# EasyEDA Pro project BLDC大功率驱动器.epro, board PCB1
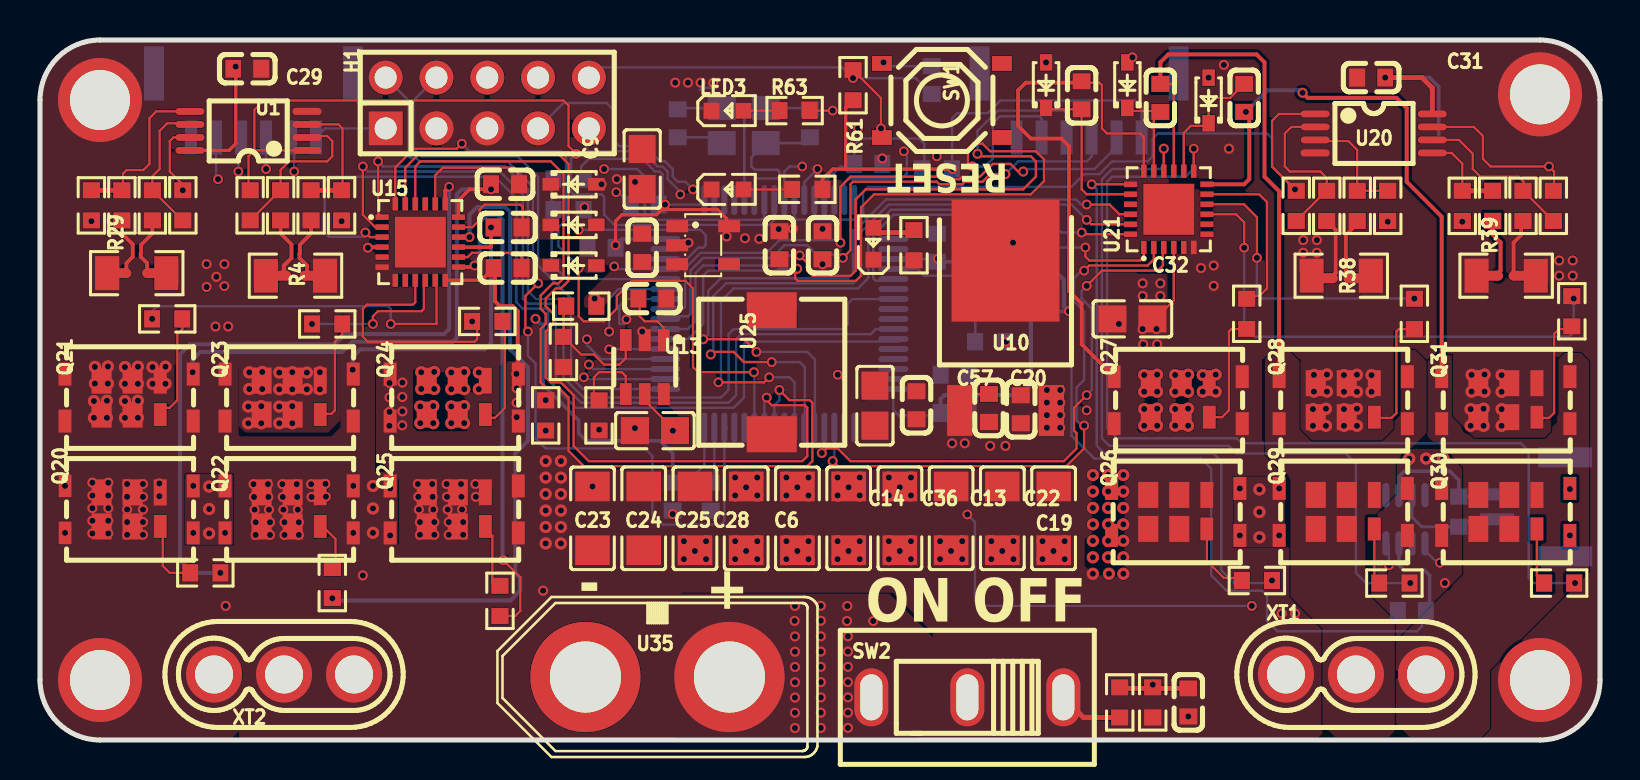
[diagram p3: board, top side]
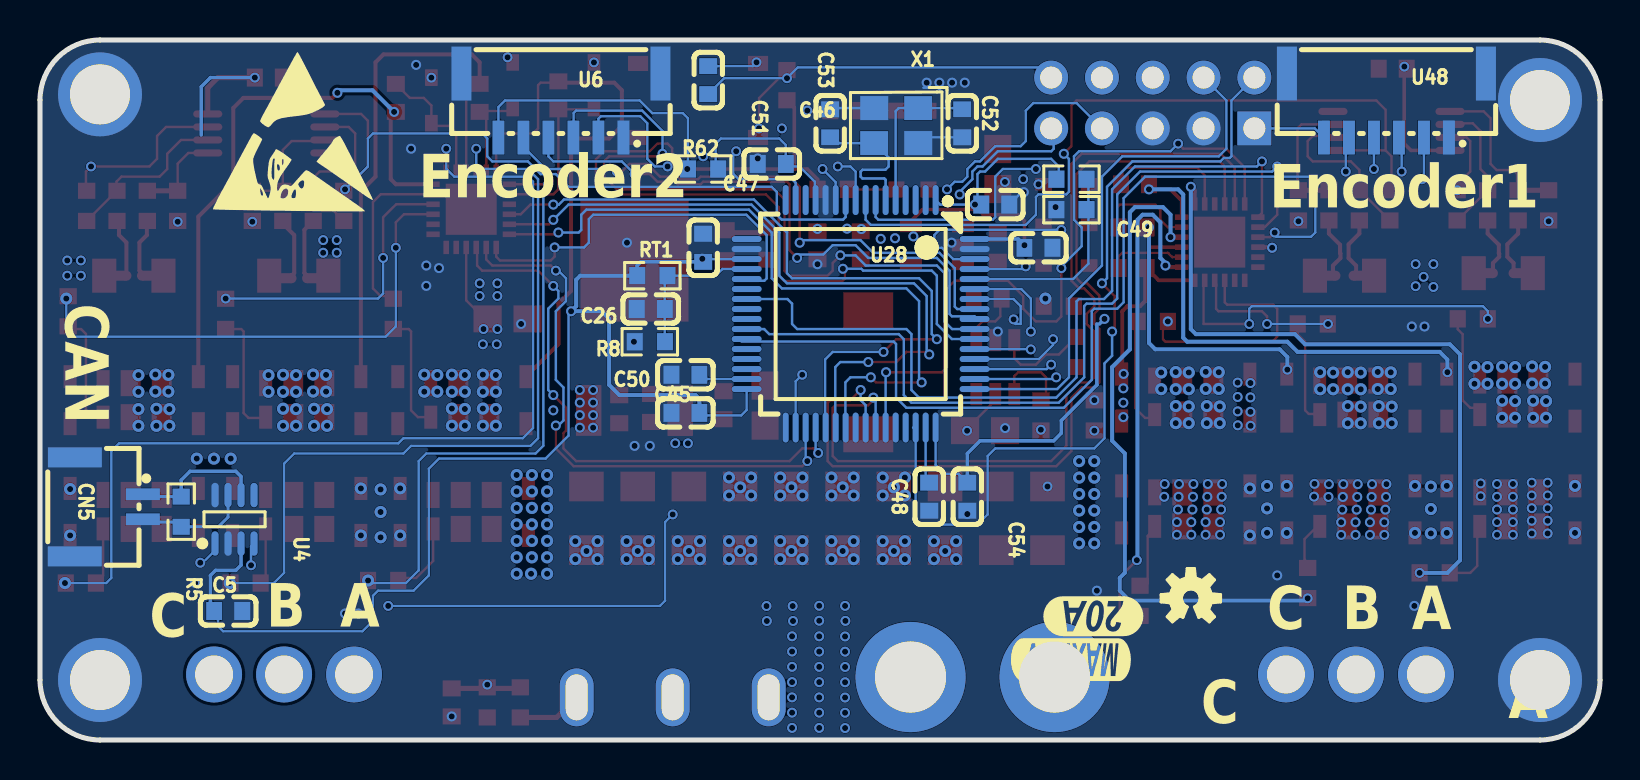
[diagram p4: board, bottom side, seen from below]

Outline 78 x 35 mm; copper layers: Top Layer, Inner1, Inner2, Bottom Layer. Coordinates in mm from the lower left corner of the outline.
Outline path: 0,32 0,3 arc(0.88,0.88) 3,0 75,0 arc(77.12,0.88) 78,3 78,32 arc(77.12,34.12) 75,35 3,35 arc(0.88,34.12) 0,32
Stack: Top Layer 0.035mm 外层铜厚1oz / Dielectric1 0.2104mm 7628 RC49% 8.6mil / Inner1 0.0152mm 内层铜厚 / Dielectric2 1.065mm 1.1mm H/HOZ Copper / Inner2 0.0152mm 内层铜厚 / Dielectric3 0.2104mm 7628 RC49% 8.6mil / Bottom Layer 0.035mm 外层铜厚1oz

## Design rules (mm)
net SPB1: DP4
net SPA1: DP3
net SPB2: DP1
net SPC2: DP2
net OS_8M_IN: DP5
net OS_8M_OUT: DP5
net SNB1: DP4
net SNA1: DP3
net SNC2: DP2
net SNB2: DP1
template: 自定义配置
spacing copperThickness1oz (default): track to track 0.076, other pairs 0.102 to 0.3
spacing copperThickness2oz: track to track 0.203, other pairs 0.152 to 0.3
track width copperThickness1oz (default): min 0.102, default 0.119, max 2.54
track width copperThickness2oz: min 0.102, default 0.119, max 2.54
differential pair differentialPair (default): width min 0.127, default 0.254, max 2.54; gap min 0.152, default 0.152
via viaSize (default): diameter min 0.5, default 0.5, max 10; hole min 0.3, default 0.305, max 6.3
net SHB2 uses copperRegion1
net SHC2 uses copperRegion1
net SPC2 uses copperRegion1

## Placement (name value [footprint] x y rotation side)
1  OSHW-LOGOS  [OSHW-LOGO-S]  20.46 7.09 180 bottom
BOOT_RES  0  [R0603]  26.43 28.04 180 bottom
C1  2.2uF 16V  [C0603]  23.38 25.63 0 top
C5  100nf 6.3v  [C0603]  68.59 6.45 180 bottom
C6  4.7uF/50V  [C1206]  37.87 11.08 270 top
C9  10uF 16V  [C0805]  30.11 28.55 90 top
C10  4.7uf 16V  [C0603]  43.83 16.74 90 top
C13  4.7uF/50V  [C1206]  45.56 11.08 270 top
C14  4.7uF/50V  [C1206]  40.43 11.08 270 top
C16  100nf 6.3v  [C0603]  57.41 1.88 90 top
C17  10uF 16V  [C0805]  41.75 16.72 90 top
C18  2.2uF 16V  [C0603]  23.38 23.6 0 top
C19  4.7uF/50V  [C1206]  50.68 11.08 270 top
C20  1uF  [C0603]  49.04 16.54 270 top
C22  4.7uF/50V  [C1206]  48.12 11.08 270 top
C23  4.7uF/50V  [C1206]  27.62 11.08 270 top
C24  4.7uF/50V  [C1206]  30.19 11.08 270 top
C25  4.7uF/50V  [C1206]  32.75 11.08 270 top
C26  2.2uf 6.3V  [C0603]  47.46 21.55 0 bottom
C27  2.2uF 16V  [C0603]  23.25 27.79 0 top
C28  4.7uF/50V  [C1206]  35.31 11.08 270 top
C29  100nf 6.3v  [C0603]  10.36 33.56 0 top
C31  100nf 6.3v  [C0603]  66.56 33.12 180 top
C32  10uF 16V  [C0805]  54.62 21.06 180 top
C33  2.2uF 16V  [C0603]  56.02 32.11 270 top
C34  2.2uF 16V  [C0603]  60.21 32.11 90 top
C35  2.2uF 16V  [C0603]  52.08 32.23 270 top
C36  4.7uF/50V  [C1206]  43 11.08 270 top
C39  100nf 50V  [C0603]  30.62 22.07 0 top
C40  2.2uf 100V  [C0805]  30.75 15.47 0 top
C41  1uf 6.3v  [C0603]  30.11 24.61 270 top
C42  100nf 6.3v  [C0603]  39.13 24.74 90 top
C43  1uf 6.3v  [C0603]  36.97 24.74 90 top
C44  100nF  [C0603]  30.24 26.77 180 bottom
C45  100nF  [C0603]  45.73 16.36 0 bottom
C46  100nF  [C0603]  41.41 28.8 0 bottom
C47  100nF  [C0603]  44.84 24.61 90 bottom
C48  2.2uF  [C0603]  33.54 12.17 270 bottom
C49  100nF  [C0603]  28.08 24.61 0 bottom
C50  2.2uF  [C0603]  45.73 18.26 180 bottom
C51  100nF  [C0603]  44.59 32.99 90 bottom
C52  20pF  [C0603]  31.89 30.83 270 bottom
C53  20pF  [C0603]  38.49 30.83 270 bottom
C54  100nF  [C0603]  31.63 12.17 90 bottom
C57  10uF  [C0603]  47.45 16.6 270 top
CN5  GH1.25-2P  [CONN-SMD_2P-P1.25_GH1.25-2P]  74.56 11.66 270 bottom
H1  -  [HDR-TH_10P-P2.54-V-M-R2-C5-S2.54]  22.36 31.85 0 top
LED3  -  [LED_0603]  34.43 31.47 0 top
LED4  -  [LED_0603]  34.43 27.53 0 top
LED5  -  [LED_0603]  41.67 24.87 90 top
Q20  IRF7480MTRPBF  [TRS-SMD_IRF7480MTRPBF]  4.46 11.53 180 top
Q21  IRF7480MTRPBF  [TRS-SMD_IRF7480MTRPBF]  4.46 17.12 180 top
Q22  IRF7480MTRPBF  [TRS-SMD_IRF7480MTRPBF]  12.46 11.53 180 top
Q23  IRF7480MTRPBF  [TRS-SMD_IRF7480MTRPBF]  12.46 17.12 180 top
Q24  IRF7480MTRPBF  [TRS-SMD_IRF7480MTRPBF]  20.71 17.12 180 top
Q25  IRF7480MTRPBF  [TRS-SMD_IRF7480MTRPBF]  20.71 11.53 180 top
Q26  IRF7480MTRPBF  [TRS-SMD_IRF7480MTRPBF]  56.79 11.4 180 top
Q27  IRF7480MTRPBF  [TRS-SMD_IRF7480MTRPBF]  56.91 16.99 180 top
Q28  IRF7480MTRPBF  [TRS-SMD_IRF7480MTRPBF]  65.16 16.99 180 top
Q29  IRF7480MTRPBF  [TRS-SMD_IRF7480MTRPBF]  65.16 11.4 180 top
Q30  IRF7480MTRPBF  [TRS-SMD_IRF7480MTRPBF]  73.29 11.4 180 top
Q31  IRF7480MTRPBF  [TRS-SMD_IRF7480MTRPBF]  73.29 16.99 180 top
R1  2.2R  [R0603]  8.27 8.36 0 top
R2  2.2R  [R0603]  6.36 21.06 180 top
R4  1mR  [R1206]  12.77 23.22 0 top
R5  120R  [R0603]  70.94 11.42 90 bottom
R8  3.3k  [R0603]  47.51 19.91 180 bottom
R11  1k  [R0603]  55.64 1.88 90 top
R12  2.2R  [R0603]  14.62 7.85 270 top
R13  2.2R  [R0603]  14.36 20.8 180 top
R15  30K  [R0603]  7.14 26.73 90 top
R16  30K  [R0603]  10.51 26.73 90 top
R18  0R  [R0603]  25.28 16.23 90 top
R19  1K  [R0603]  12.03 26.73 270 top
R20  30K  [R0603]  2.57 26.73 90 top
R21  510R  [R0603]  13.56 26.73 270 top
R22  30K  [R0603]  15.08 26.73 270 top
R23  1K  [R0603]  5.62 26.73 90 top
R24  18k  [R0603]  53.99 1.88 270 top
R26  510R  [R0603]  4.09 26.73 90 top
R27  2.2R  [R0603]  23 6.96 270 top
R28  2.2R  [R0603]  22.36 20.93 180 top
R29  1mR  [R1206]  4.84 23.34 180 top
R30  1K  [R0603]  26.17 19.41 90 top
R31  100K  [R0603]  27.95 16.23 270 top
R38  1mR  [R1206]  65.06 23.22 0 top
R39  1mR  [R1206]  73.31 23.22 180 top
R40  2.2R  [R0603]  60.84 7.97 0 top
R41  2.2R  [R0603]  60.34 21.31 90 top
R42  2.2R  [R0603]  67.72 7.85 0 top
R43  2.2R  [R0603]  68.72 21.31 90 top
R44  2.2R  [R0603]  75.96 7.85 0 top
R45  2.2R  [R0603]  76.59 21.44 90 top
R51  30K  [R0603]  75.67 26.71 90 top
R52  30K  [R0603]  71.12 26.71 90 top
R53  510R  [R0603]  72.63 26.71 90 top
R54  1K  [R0603]  74.15 26.71 90 top
R55  30K  [R0603]  62.81 26.71 90 top
R56  30K  [R0603]  67.38 26.71 270 top
R57  1K  [R0603]  64.34 26.71 270 top
R58  510R  [R0603]  65.86 26.71 270 top
R59  5.36K  [R0603]  27.06 21.69 0 top
R60  1.5K  [R0603]  26.43 26.52 0 bottom
R61  10K  [R0603]  40.65 32.74 90 top
R62  0  [R0603]  44.84 28.55 180 bottom
R63  10K  [R0603]  37.73 31.47 180 top
R64  10K  [R0603]  38.37 27.53 180 top
R65  10K  [R0603]  43.7 24.74 90 top
RT1  10k  [R0603]  47.38 23.22 0 bottom
SW1  TS-1187A-B-A-B  [SW-SMD_4P-L5.1-W5.1-P3.70-LS6.5-TL_H1.5]  45.1 31.98 0 top
SW2  SS12D10G4  [SW-TH_3P-P4.80-HX-SS12D10G4]  46.37 2.13 180 top
U1  LMV358IPWRG4  [TSSOP-8_L4.4-W3.0-P0.65-LS6.4-BL]  10.42 30.45 90 top
U4  MAX3051EKA+T  [SOT-23-8_L3.0-W1.7-P0.65-LS2.8-TL]  68.27 11.04 90 bottom
U6  GH1.25-6PWBPZ  [CONN-SMD_6P-P1.25_GH1.25-6PWBPZ]  51.95 31.72 0 bottom
U10  CJ7812  [TO-252-3_L6.5-W5.8-P4.58-BL]  48.28 20.22 0 top
U13  JW5026  [SOT-23-6_L2.9-W1.6-P0.95-LS2.8-BR]  30.24 18.64 90 top
U14  SPX3819M5-L-3-3/TR  [SOT-23-5_L3.0-W1.7-P0.95-LS2.8-BR]  33.16 24.74 180 top
U15  FD6288Q_C328453  [QFN-24_L4.0-W4.0-P0.50-BL-EP2.6]  19.01 24.89 270 top
U16  1N5819WS  [SOD-323_L1.7-W1.3-LS2.6-RD]  26.68 23.72 0 top
U17  1N5819WS  [SOD-323_L1.7-W1.3-LS2.6-RD]  26.68 27.79 0 top
U18  1N5819WS  [SOD-323_L1.7-W1.3-LS2.6-RD]  26.68 25.75 0 top
U20  LMV358IPWRG4  [TSSOP-8_L4.4-W3.0-P0.65-LS6.4-BL]  66.69 30.33 270 top
U21  FD6288Q_C328453  [QFN-24_L4.0-W4.0-P0.50-BL-EP2.6]  56.44 26.54 0 top
U22  1N5819WS  [SOD-323_L1.7-W1.3-LS2.6-RD]  58.43 31.98 90 top
U23  1N5819WS  [SOD-323_L1.7-W1.3-LS2.6-RD]  50.3 32.74 90 top
U24  1N5819WS  [SOD-323_L1.7-W1.3-LS2.6-RD]  54.37 32.74 90 top
U25  4.7uH 3A  [IND-SMD_L7.3-W7.3_GSDRH74P]  36.59 18.39 90 top
U28  stm32f407rgt6  [LQFP-64_L10.0-W10.0-P0.50-LS12.0-BL]  36.97 21.31 0 bottom
U29  -  [M3]  75 3 0 top
U30  -  [M3]  75 32.28 0 top
U31  -  [M3]  3 3 0 top
U32  -  [M3]  3 32 0 top
U35  XT60PB-M  [CONN-TH_XT60PB-M]  30.87 3.15 0 top
U38  -  [网络连接]  64.15 23.09 180 top
U39  -  [网络连接]  65.92 23.09 0 top
U40  -  [网络连接]  72.4 23.22 180 top
U41  -  [网络连接]  74.18 23.22 0 top
U44  -  [网络连接]  11.82 23.22 180 top
U45  -  [网络连接]  13.73 23.22 0 top
U46  -  [网络连接]  3.82 23.34 180 top
U47  -  [网络连接]  5.85 23.34 0 top
U48  GH1.25-6PWBPZ  [CONN-SMD_6P-P1.25_GH1.25-6PWBPZ]  10.68 31.72 0 bottom
X1  8MHz  [CRYSTAL-SMD_4P-L3.2-W2.5-BL-1]  35.19 30.72 0 bottom
XT1  MR30  [CONN-TH_MR30PB-M]  65.8 3.28 0 top
XT2  MR30  [CONN-TH_MR30PB-M]  12.2 3.28 0 top

## Footprints (pads in the part's own frame, mm; a bottom-side part is the same pattern mirrored in y, then rotated)
C0603
  rect 0.8x0.9 smd: 1(-0.7,0) 2(0.7,0)
C0805
  rect 1.41x1.35 smd: 1(-1,0) 2(1,0)
C1206
  rect 1.485x1.728 smd: 1(-1.593,0) 2(1.593,0)
CONN-SMD_2P-P1.25_GH1.25-2P
  rect 0.6x1.7 smd: 1(-0.625,1.702) 2(0.625,1.702)
  rect 1x2.7 smd: 3(2.475,-1.702) 4(-2.475,-1.698)
CONN-SMD_6P-P1.25_GH1.25-6PWBPZ
  rect 0.6x1.7 smd: 1(-3.125,1.6) 2(-1.875,1.6) 3(-0.625,1.6) 4(0.625,1.6) 5(1.875,1.6) 6(3.125,1.6)
  rect 1x2.7 smd: 7(-4.975,-1.6) 8(4.975,-1.6)
CONN-TH_MR30PB-M
  round 2.8 hole 1.9: 1(-3.5,0) 2(0,0) 3(3.5,0)
CONN-TH_XT60PB-M
  round 5.516 hole 3.556: 1(3.6,0) 2(-3.6,0)
CRYSTAL-SMD_4P-L3.2-W2.5-BL-1
  rect 1.4x1.2 smd: 1(-1.1,-0.875) 2(1.1,-0.875) 3(1.1,0.875) 4(-1.1,0.875)
HDR-TH_10P-P2.54-V-M-R2-C5-S2.54
  rect 1.7x1.7 hole 1.1: 1(-5.08,-1.27)
  round 1.7 hole 1.1: 2(-5.08,1.27) 3(-2.54,-1.27) 4(-2.54,1.27) 5(0,-1.27) 6(0,1.27) 7(2.54,-1.27) 8(2.54,1.27) 9(5.08,-1.27) 10(5.08,1.27)
IND-SMD_L7.3-W7.3_GSDRH74P
  rect 1.8x2.5 smd: 1(-3.1,0) 2(3.1,0)
LED_0603
  rect 0.8x0.8 smd: 1(-0.851,-0.01) 2(0.75,-0.005)
LQFP-64_L10.0-W10.0-P0.50-LS12.0-BL
  oval 0.3x1.5 smd: 1(-3.75,-5.688) 2(-3.25,-5.688) 3(-2.75,-5.688) 4(-2.25,-5.688) 5(-1.75,-5.688) 6(-1.25,-5.688) 7(-0.75,-5.688) 8(-0.25,-5.688) 9(0.25,-5.688) 10(0.75,-5.688) 11(1.25,-5.688) 12(1.75,-5.688) 13(2.25,-5.688) 14(2.75,-5.688) 15(3.25,-5.688) 16(3.75,-5.688) 33(3.75,5.688) 34(3.25,5.688) 35(2.75,5.688) 36(2.25,5.688) 37(1.75,5.688) 38(1.25,5.688) 39(0.75,5.688) 40(0.25,5.688) 41(-0.25,5.688) 42(-0.75,5.688) 43(-1.25,5.688) 44(-1.75,5.688) 45(-2.25,5.688) 46(-2.75,5.688) 47(-3.25,5.688) 48(-3.75,5.688)
  oval 1.5x0.3 smd: 17(5.7,-3.738) 18(5.7,-3.238) 19(5.7,-2.738) 20(5.7,-2.238) 21(5.7,-1.738) 22(5.7,-1.238) 23(5.7,-0.739) 24(5.7,-0.238) 25(5.7,0.262) 26(5.7,0.762) 27(5.7,1.262) 28(5.7,1.762) 29(5.7,2.261) 30(5.7,2.762) 31(5.7,3.261) 32(5.7,3.762) 49(-5.7,3.762) 50(-5.7,3.261) 51(-5.7,2.762) 52(-5.7,2.261) 53(-5.7,1.762) 54(-5.7,1.262) 55(-5.7,0.762) 56(-5.7,0.262) 57(-5.7,-0.238) 58(-5.7,-0.739) 59(-5.7,-1.238) 60(-5.7,-1.738) 61(-5.7,-2.238) 62(-5.7,-2.738) 63(-5.7,-3.238) 64(-5.7,-3.738)
M3
  round 4.2 hole 3: 1(0,0)
QFN-24_L4.0-W4.0-P0.50-BL-EP2.6
  rect 0.28x0.665 smd: 1(-1.25,-1.907) 2(-0.75,-1.907) 3(-0.25,-1.907) 4(0.25,-1.907) 5(0.75,-1.907) 6(1.25,-1.907) 13(1.25,1.907) 14(0.75,1.907) 15(0.25,1.907) 16(-0.25,1.907) 17(-0.75,1.907) 18(-1.25,1.907)
  rect 0.665x0.28 smd: 7(1.907,-1.25) 8(1.907,-0.75) 9(1.907,-0.25) 10(1.907,0.25) 11(1.907,0.75) 12(1.907,1.25) 19(-1.907,1.25) 20(-1.907,0.75) 21(-1.907,0.25) 22(-1.907,-0.25) 23(-1.907,-0.75) 24(-1.907,-1.25)
  rect 2.55x2.55 smd: 25(0,0)
R0603
  rect 0.806x0.864 smd: 1(-0.753,0) 2(0.753,0)
R1206
  rect 1.208x1.701 smd: 1(-1.479,0) 2(1.479,0)
SOD-323_L1.7-W1.3-LS2.6-RD
  rect 0.83x0.63 smd: 1(-1.14,0) 2(1.14,0)
SOT-23-5_L3.0-W1.7-P0.95-LS2.8-BR
  rect 1.1x0.6 smd: 1(1.3,-0.95) 2(1.3,0) 3(1.3,0.95) 4(-1.3,0.95) 5(-1.3,-0.95)
SOT-23-6_L2.9-W1.6-P0.95-LS2.8-BR
  rect 1.1x0.6 smd: 1(1.35,-0.95) 2(1.35,0) 3(1.35,0.95) 4(-1.35,0.95) 5(-1.35,0) 6(-1.35,-0.95)
SOT-23-8_L3.0-W1.7-P0.65-LS2.8-TL
  oval 1.222x0.364 smd: 1(-1.211,0.975) 2(-1.211,0.325) 3(-1.211,-0.325) 4(-1.211,-0.975) 5(1.211,-0.975) 6(1.211,-0.325) 7(1.211,0.325) 8(1.211,0.975)
SW-SMD_4P-L5.1-W5.1-P3.70-LS6.5-TL_H1.5
  rect 1x0.75 smd: 1(-3,1.85) 2(3,1.85) 3(-3,-1.85) 4(3,-1.85)
SW-TH_3P-P4.80-HX-SS12D10G4
  oval 1.7x2.9 hole 1.1x2.3: 1(-4.8,0) 2(0,0) 3(4.8,0)
TO-252-3_L6.5-W5.8-P4.58-BL
  rect 1.27x2.54 smd: 1(-2.288,-3.747) 3(2.288,-3.745)
  rect 5.4x6.1 smd: 2(-0.002,3.747)
TRS-SMD_IRF7480MTRPBF
  rect 0.65x1.15 smd: 1(-1.555,0.85) 7(-3.205,1.175) 8(-3.205,-1.175) 9(3.205,-1.175) 10(3.205,1.175)
  rect 1x1.3 smd: 2(-0.175,0.85) 3(1.375,0.85) 4(1.375,-0.85) 5(-0.175,-0.85)
  rect 0.65x1.3 smd: 6(-1.555,-0.85)
TSSOP-8_L4.4-W3.0-P0.65-LS6.4-BL
  oval 0.353x1.454 smd: 1(-0.975,-2.927) 2(-0.325,-2.927) 3(0.325,-2.927) 4(0.975,-2.927) 5(0.975,2.927) 6(0.325,2.927) 7(-0.325,2.927) 8(-0.975,2.927)
网络连接
  round 0.5 smd: 1(-0.5,0) 2(0.5,0)

## Nets
As in the schematic.

Pads without a net: H1 6 8; SW1 2 4; U4 5; U14 4; U15 5 7 8 21 25; U21 5 7 8 21 25; U28 2 3 4 14 22 44 45

## Via types
v1: diameter 0.5, hole 0.305, Top Layer to Bottom Layer, 291 vias
v2: diameter 0.61, hole 0.305, Top Layer to Bottom Layer, 234 vias
v3: diameter 0.508, hole 0.305, Top Layer to Bottom Layer, 2 vias

## Routing (per net, layer and track width the routed paths; a pad name or vN(x,y) marks a point on that pad's centre or on a via; arc(x,y) is an arc through that point)
5V:
  vias: v2(27.73,22.07)
12V: length 17.6
  Top Layer w0.119: U21.4 56.69,21.98 56.27,21.56 55.62,21.56
  Top Layer w0.201: 17.1,24.64 16.43,24.64 v3(16.39,24.61)
  Inner2 w0.178: v3(16.39,24.61) 24.4,24.61 27.57,27.79 v1(28.08,27.79)
  vias: v1(28.84,28.04) v1(29.75,27.9) v1(50.3,33.88) v1(50.34,17.5) v1(50.34,16.87) v1(50.34,16.24) v1(50.34,15.61) v1(51.01,17.5) v1(51.01,16.87) v1(51.01,16.24) v1(51.01,15.61) v1(54.62,34.13) v1(55.13,22.83) v1(55.13,22.2) v1(55.13,20.55) v1(55.16,19.79) v1(55.83,20.55) v1(55.86,19.79) v1(56.02,22.83) v1(56.02,22.2) v1(58.43,33.12)
DGND: length 8
  Inner2 w0.119: 28.84,16.74 29.75,15.83 v1(29.75,15.59)
  Bottom Layer w0.119: C53.1 38.43,31.6 X1.2 ; 32.98,32.49 33.11,32.61 33.83,32.61 ; v1(28.81,27.39) 28.92,27.39 C44.2 ; 34.09,29.84 33.8,30.14 31.89,30.14
  vias: v1(8.77,20.67) v1(9.28,6.7) v1(9.41,20.67) v1(16.14,8.23) v1(25.16,7.47) v1(25.28,16.99) v1(27.22,26.64) v1(30.11,20.42) v1(31.63,11.3) v1(31.76,32.87) v1(32.4,32.87) v1(32.42,24.87) v1(33.03,32.87) v1(33.67,32.87) v1(39.13,23.79) v1(42.11,29.08) v1(47.51,14.71) v1(48.3,19.91) v1(48.27,14.71) v1(48.65,24.87) v1(53.95,20.8) v1(57.41,1.18) v1(58.05,23.6) v1(58.69,23.72) v1(58.69,22.71) v1(59.19,33.76) v1(59.45,29.56) v1(62.09,6.32) v1(62.75,6.32) v1(70.24,7.85)
PGND: length 0
  Top Layer w0.119: R18.1 v1(25.28,15.47)
  vias: v1(8.33,23.79) v1(8.33,22.65) v1(8.82,23.16) v1(9.22,23.79) v1(9.22,22.69) v1(27.62,12.68) v1(63.16,25) v1(63.16,24.36) v1(63.84,25) v1(63.84,24.36) v1(75.96,23.98) v1(75.96,23.22) v1(76.64,23.98) v1(76.64,23.22) v2(19.01,16.68) v2(19.01,15.84) v2(19.06,18.39) v2(19.06,17.55) v2(19.71,18.41) v2(19.71,17.55) v2(19.66,16.7) v2(19.66,15.84) v2(20.56,18.38) v2(20.56,17.54) v2(20.56,16.68) v2(20.56,15.84) v2(21.21,18.4) v2(21.21,17.54) v2(21.21,16.7) v2(21.21,15.84) v2(21.94,18.38) v2(21.94,17.54) v2(34.76,13.12) v2(34.76,12.23) v2(35.3,12.63) v2(35.86,13.12) v2(35.86,12.23) v2(37.32,13.12) v2(37.32,12.23) v2(37.87,12.63) v2(38.42,13.12) v2(38.42,12.23) v2(39.88,13.12) v2(39.88,12.23) v2(40.43,12.63) v2(40.99,13.12) v2(40.99,12.23) v2(42.44,13.12) v2(42.44,12.23) v2(42.99,12.63) v2(43.55,13.12) v2(43.55,12.23) v2(55.21,18.25) v2(55.21,17.41) v2(55.21,16.55) v2(55.21,15.71) v2(55.86,18.27) v2(55.86,17.41) v2(55.86,16.57) v2(55.86,15.71) v2(56.76,18.25) v2(56.76,17.41) v2(56.76,16.55) v2(56.76,15.71) v2(57.41,18.27) v2(57.41,17.41) v2(57.41,16.57) v2(57.41,15.71) v2(58.14,18.25) v2(58.14,17.41) v2(58.79,18.27) v2(58.79,17.41)
VBUS_S_PA1: length 47.7
  Top Layer w0.254: C16.2 54.04,2.58 R24.1
  Inner1 w0.119: v1(55.64,2.77) 55.38,3.02 55.38,13.94 55.13,14.2 53.22,14.2 52.72,14.71 52.72,16.36 52.59,16.48 v1(52.34,16.48) 52.84,16.99 52.84,18.77 51.95,19.66 51.95,22.07 51.45,22.58 51.45,29.18 50.3,30.33 44.08,30.33 v1(43.19,29.44)
  Bottom Layer w0.119: v1(43.19,29.44) 43.34,29.29 43.34,28.32 43.06,28.04 40.4,28.04 40.22,27.86 U28.15
VCC: length 146.4
  Top Layer w0.178: C29.1 9.79,33.44 9.79,29.82 9.45,29.48 U1.8 ; R64.1 39.12,28.03 39.63,28.55 40.28,28.55 ; 40.28,28.55 v1(45.64,28.55) ; 40.28,28.55 40.28,31.62 R61.1 ; v1(28.78,24.74) 28.78,25.95 29.09,26.26 30.83,26.26 31.13,26.56 31.16,26.52 33.88,26.52 34.33,26.07 v1(34.33,25.18)
  Top Layer w0.254: v1(67.26,33.12) 69.1,33.12 69.61,32.61 U20.8
  Inner2 w0.178: v1(44.88,24.06) 44.88,21.31
  Bottom Layer w0.119: 69.16,6.45 69.1,6.39 69.1,5.69 68.84,5.44 61.88,5.44 61.35,5.96 61.35,7.21 61.1,7.47 59.32,7.47 58.56,8.23 58.56,13.56 58.05,14.07 52.72,14.07 51.57,15.21 51.57,21.31 v1(51.45,21.44) ; U28.1 32.99,26.77 v1(31.25,26.77) 31.13,26.9 31.13,28.3 31,28.42 30.75,28.42 30.11,29.06 27.44,29.06 27.06,28.68 27.06,28.17 26.94,28.04 BOOT_RES.1 ; U6.6 55.08,31.65 54.75,31.98 48.02,31.98 47.38,31.34 45.86,31.34 45.6,31.09 45.6,28.56 R62.1 ; H1.1 14.26,30.58 U48.6 ; U28.19 44.71,24.05 C47.1 ; U28.48 33.22,13.75 32.78,13.31 32.08,13.31 C54.2 ; C45.1 44.9,16.23 42.94,16.23 42.67,16.5 U28.32
  Bottom Layer w0.178: 67.95,9.57 67.95,8.75 68.21,8.48 69.23,8.48 69.48,8.23 69.48,6.64 C5.1 ; 69.94,30.25 69.94,32.66 69.48,33.12 v1(67.26,33.12) ; 25.16,20.8 25.16,17.75 26.94,15.98 26.94,15.34 27.32,14.96 31,14.96 31.63,14.33 C54.2 ; 25.03,20.8 v1(24.78,21.06) ; RT1.2 48.14,23.22 48.14,23.72 47.96,23.91 C47.1 44.88,23.95 v1(44.88,24.06) ; U28.64 29.09,25.05 v1(28.78,24.74) ; v1(31.25,26.77) C44.1
  Bottom Layer w0.203: RT1.2 50.99,23.22 51.19,23.01 51.19,21.69 v1(51.45,21.44) 49.92,21.44 49.54,21.06 49.54,17.75 49.03,17.25 45.22,17.25 45.03,17.05 C45.1
  vias: v1(2.57,25.94) v1(9.78,33.67) v1(15.08,25.94) v1(35.25,25.09) v1(35.96,25.06) v1(36.93,25.55) v1(37.65,25.57) v1(39.13,25.56) v1(67.38,25.91) v1(71.12,25.91)
CAN1_RX: length 57.8
  Inner1 w0.119: v1(60.59,6.7) 61.48,6.7 63.51,8.74 v1(67.45,8.74) ; v1(46.37,11.28) 46.37,12.93 44.84,14.45 44.84,17.37 44.46,17.75 39.25,17.75 39,18.01 39,22.2 38.37,22.83 29.56,22.83 v1(28.71,23.68)
  Bottom Layer w0.119: U4.4 67.45,9.67 v1(67.45,8.74) ; v1(46.37,11.28) 46.75,10.9 46.75,6.96 47,6.7 v1(60.59,6.7) ; v1(28.71,23.68) 28.85,23.55 U28.61
CAN1_TX: length 78.4
  Inner1 w0.119: v1(69.99,8.86) 68.08,8.86 67.7,9.25 63.38,9.25 62.88,9.75 62.88,13.31 61.1,15.09 61.1,23.22 61.48,23.6 61.48,24.87 60.72,25.63 60.72,29.82 59.83,30.71 43.06,30.71 42.3,29.95 41.54,29.95 v1(40.91,30.58)
  Inner2 w0.119: v1(40.91,30.58) 40.91,26.39 40.65,26.14 27.57,26.14 v1(26.94,25.5)
  Bottom Layer w0.119: v1(26.94,25.5) 26.94,25.51 33.02,25.51 33.28,25.25 33.28,24.74 33.16,24.61 32.9,24.61 32.34,24.05 U28.62 ; U4.1 69.25,9.48 69.73,8.99
CAN_H: length 5.7
  Bottom Layer w0.152: U4.7 68.6,11.14 69.08,10.66 R5.1 71.17,10.9 72.72,10.9 CN5.2
CAN_L: length 7.1
  Bottom Layer w0.152: 72.92,12.3 72.8,12.17 R5.2
  Bottom Layer w0.178: R5.2 70.94,12.99 70.5,13.44 68.21,13.44 67.95,13.17 U4.6
DCBUS: length 7.5
  Top Layer w0.119: U13.5 30.24,16.98 C40.2 ; C57.1 46.82,17.3 U10.1
  Top Layer w0.254: SW2.1 52.17,1.13 R24.2
  vias: v1(27.96,15.52) v1(31.65,15.46) v1(45.6,14.83) v1(46.24,14.84) v2(1.25,12.71) v2(1.25,10.36) v2(7.66,12.71) v2(7.66,10.36) v2(8.46,12.67) v2(8.46,11.55) v2(8.46,10.33) v2(9.25,12.71) v2(9.25,10.36) v2(15.66,12.71) v2(15.66,10.36) v2(16.65,12.7) v2(16.65,11.58) v2(16.65,10.36) v2(17.51,12.58) v2(17.51,10.23) v2(25.28,13.94) v2(25.28,13.12) v2(25.28,12.3) v2(25.28,11.47) v2(25.28,10.65) v2(25.28,9.83) v2(26.05,13.94) v2(26.05,13.12) v2(26.05,12.3) v2(26.05,11.47) v2(26.05,10.65) v2(26.05,9.83) v2(32.19,9.94) v2(32.19,9.04) v2(32.74,9.45) v2(33.3,9.94) v2(33.3,9.04) v2(34.76,9.94) v2(34.76,9.04) v2(35.3,9.45) v2(35.86,9.94) v2(35.86,9.04) v2(37.32,9.94) v2(37.32,9.04) v2(37.87,9.45) v2(38.42,9.94) v2(38.42,9.04) v2(39.88,9.94) v2(39.88,9.04) v2(40.43,9.45) v2(40.99,9.94) v2(40.99,9.04) v2(42.44,9.94) v2(42.44,9.04) v2(42.99,9.45) v2(43.55,9.94) v2(43.55,9.04) v2(45,9.94) v2(45,9.04) v2(45.55,9.45) v2(46.11,9.94) v2(46.11,9.04) v2(47.56,9.94) v2(47.56,9.04) v2(48.11,9.45) v2(48.67,9.94) v2(48.67,9.04) v2(50.13,9.94) v2(50.13,9.04) v2(50.67,9.45) v2(51.23,9.94) v2(51.23,9.04) v2(52.64,13.25) v2(52.64,12.43) v2(52.64,11.6) v2(52.64,10.78) v2(52.64,9.96) v2(52.64,9.13) v2(52.64,8.31) v2(53.41,13.25) v2(53.41,12.43) v2(53.41,11.6) v2(53.41,10.78) v2(53.41,9.96) v2(53.41,9.13) v2(53.45,8.31) v2(54.17,13.25) v2(54.17,12.43) v2(54.17,11.6) v2(54.17,10.78) v2(54.17,9.96) v2(54.17,9.13) v2(54.17,8.31) v2(59.99,12.58) v2(59.99,10.23) v2(60.97,12.53) v2(60.97,11.4) v2(60.97,10.13) v2(61.96,12.58) v2(61.96,10.23) v2(68.46,14.07) v2(69.3,14.07) v2(70.16,14.07) v2(76.5,12.55) v2(76.5,10.23)
ENC_SPI1_CS: length 39.5
  Top Layer w0.119: v1(46.62,28.68) 46.51,28.68 46.39,28.8 46.39,29.59 46.62,29.82 47.13,29.82 47.51,29.44 49.79,29.44 50.2,29.03 50.2,27.94 49.54,27.28 41.7,27.28 41.06,26.64 41.06,23.21 40.81,22.95 37.88,22.95 37.76,23.07 37.76,23.46 v1(37.86,23.56)
  Bottom Layer w0.119: v1(46.62,28.68) 47.25,28.68 47.64,29.06 47.64,30.83 47.99,31.19 49.96,31.19 50.08,31.07 U6.2 ; v1(37.86,23.56) 36.93,23.56 36.84,23.47 33.41,23.47 33.16,23.22 33.16,20.8 32.4,20.05 U28.54
ENC_SPI1_MISO: length 29.6
  Top Layer w0.119: v1(48.27,28.3) 47.51,28.3 47.13,27.91 46.24,27.91 46.11,27.79 44.97,27.79 44.84,27.91 40.65,27.91 40.52,27.79 40.52,24.48 v1(40.14,24.1)
  Bottom Layer w0.119: U28.56 31.27,21.18 31.28,21.18 32.4,21.18 32.52,21.3 32.52,23.47 33.16,24.1 36.59,24.1 37.22,24.74 38.37,24.74 38.83,24.27 40.1,24.27 40.14,24.23 v1(40.14,24.1) ; U6.4 52.58,29.17 52.34,28.93 48.91,28.93 v1(48.27,28.3)
ENC_SPI1_MOSI: length 29.7
  Top Layer w0.119: v1(40.02,24.87) 40.02,27.66 40.52,28.17 44.97,28.17 45.1,28.04 45.99,28.04 46.11,28.17 47,28.17 47.64,28.8 48.53,28.8 48.91,28.42 v1(49.16,28.42)
  Bottom Layer w0.119: v1(49.16,28.42) 49.29,28.55 52.72,28.55 53.83,29.66 U6.5 ; v1(40.02,24.87) 40.02,24.87 39.9,24.99 36.98,24.99 36.34,24.36 33.03,24.36 32.26,23.59 32.26,21.67 32.14,21.55 U28.57
ENC_SPI1_SCK: length 37.4
  Top Layer w0.119: v1(46.87,29.31) 47,29.18 49.54,29.18 49.79,28.93 49.79,28.17 49.16,27.53 41.29,27.53 40.78,27.03 40.78,23.46 40.53,23.22 38.62,23.22 38.37,23.47 38.37,23.85 v1(37.98,24.23)
  Bottom Layer w0.119: v1(46.87,29.31) 46.87,30.45 47.89,31.47 51.2,31.47 51.32,31.35 51.32,30.13 U6.3 ; v1(37.98,24.23) 37.22,24.23 36.71,23.72 33.16,23.72 32.78,23.34 32.78,20.93 32.4,20.55 U28.55
ENC_SPI3_CS: length 33.4
  Inner2 w0.119: v1(27.19,18.14) 26.81,18.52 26.81,18.81 26.6,19.02 11.57,19.02 11.19,19.41 11.19,27.28 10.81,27.66 9.28,27.66 v1(8.9,28.04)
  Bottom Layer w0.119: U48.2 8.8,28.14 v1(8.9,28.04) ; v1(27.19,18.14) 27.28,18.05 U28.50
ENC_SPI3_MISO: length 30.6
  Inner2 w0.119: v1(27.35,20.04) 26.96,19.66 12.2,19.66 11.69,20.17 11.69,28.16 v1(11.3,28.55)
  Bottom Layer w0.119: v1(27.35,20.04) 27.35,19.76 28.05,19.05 U28.52 ; U48.4 v1(11.3,28.55)
ENC_SPI3_MOSI: length 30.3
  Inner2 w0.119: v1(12.71,28.42) 12.08,27.79 12.08,20.29 12.46,19.91 24.78,19.91 25.41,20.55 27.57,20.55 28.46,19.66 v1(28.46,19.53)
  Bottom Layer w0.119: v1(28.46,19.53) 28.47,19.55 U28.53 ; U48.5 12.71,29.97 v1(12.71,28.42)
ENC_SPI3_SCK: length 32
  Inner2 w0.119: v1(9.92,28.42) 10.04,28.3 10.68,28.3 11.44,27.53 11.44,19.66 11.82,19.28 27.19,19.28 27.44,19.02 v1(27.44,18.77)
  Bottom Layer w0.119: U28.51 27.66,18.55 v1(27.44,18.77) ; v1(9.92,28.42) 9.92,29.99 U48.3
GHA1: length 34.6
  Top Layer w0.201: v1(20.46,27.66) 20.26,27.46 20.26,26.8
  Bottom Layer w0.201: v1(20.46,27.66) 20.46,20.55 20.2,20.29 15.25,20.29 14.74,19.79 7.5,19.79 7,19.28 7,8.99 7.63,8.36 v1(9.02,8.36)
GHA2: length 30
  Top Layer w0.119: U21.19 v1(52.59,27.79)
  Bottom Layer w0.119: v2(61.6,7.97) 61.47,7.85 59.7,7.85 59.07,8.48 59.07,13.94 58.69,14.33 53.22,14.33 52.83,14.71 52.83,27.54 v1(52.59,27.79)
GHB1: length 33.3
  Top Layer w0.201: U15.16 v1(21.47,25.14)
  Bottom Layer w0.201: v1(21.47,25.14) 21.47,26.26 21.85,26.64 23.25,26.64 23.51,26.39 23.51,19.53 24.4,18.64 24.4,14.96 23.76,14.33 23.76,8.36 24.01,8.1 24.01,7.47 23.52,6.97 14.62,6.97 v1(14.62,7.09)
GHB2: length 39.9
  Top Layer w0.119: U21.16 v1(56.19,29.56)
  Bottom Layer w0.119: v1(56.19,29.56) 56.19,28.72 56.02,28.55 53.6,28.55 53.1,28.04 53.1,15.09 53.48,14.71 59.45,14.71 59.83,14.33 65.29,14.33 65.8,13.82 65.8,8.36 66.31,7.85 v2(68.51,7.85)
GHC1: length 25.6
  Top Layer w0.119: R27.2 23.77,6.21 24.01,6.45 24.01,8.14 v1(23.16,8.99)
  Top Layer w0.201: U15.13 21.65,23.64 v1(21.73,23.72)
  Bottom Layer w0.201: v1(23.16,8.99) 23.12,9.02 23.12,26.01 22.87,26.26 22.36,26.26 21.98,25.88 21.98,24.1 21.73,23.85 v1(21.73,23.72)
GHC2: length 49.4
  Top Layer w0.119: U21.13 v1(57.69,29.56)
  Bottom Layer w0.119: v1(57.69,29.56) 57.69,28.57 57.29,28.17 53.6,28.17 53.35,27.91 53.35,15.59 53.86,15.09 59.83,15.09 60.08,14.83 74.05,14.83 74.43,14.45 74.43,8.1 74.69,7.85 v2(76.75,7.85)
GLA1: length 17.4
  Top Layer w0.119: 19.82,22.66 19.82,20.8 v1(17.54,20.8)
  Bottom Layer w0.119: v1(5.61,21.06) 5.61,21.45 5.85,21.69 17.41,21.69 17.54,21.56 v1(17.54,20.8)
GLA2: length 8.8
  Top Layer w0.119: R41.2 60.34,22.19 60.34,22.2 60.97,22.2 61.35,22.58 61.35,26.9 60.96,27.29 U21.11
GLB1: length 7.5
  Top Layer w0.119: 19.31,22.9 19.31,22.9 19.2,22.78 19.2,21.56 19.08,21.44 16.9,21.44 16.65,21.18 v1(16.65,20.8)
  Top Layer w0.254: R13.2 v1(13.6,20.8)
  Bottom Layer w0.119: v1(13.6,20.8) v1(16.65,20.8)
GLB2: length 14.6
  Top Layer w0.119: U21.10 60.19,26.79 60.84,26.14 v1(60.84,24.1)
  Bottom Layer w0.119: v1(60.84,24.1) 60.84,22.33 61.1,22.07 v1(68.72,22.07)
GLC1: length 12.1
  Top Layer w0.119: U15.9 18.76,21.89 18.64,21.77 16.34,21.77 16.14,21.56 16.14,20.17 16.39,19.91 21.73,19.91 21.85,20.04 21.85,20.68 v1(21.61,20.93)
GLC2: length 25.7
  Top Layer w0.119: U21.9 59.81,26.29 60.21,25.88 v1(60.21,24.61)
  Bottom Layer w0.119: v2(76.69,22.07) 76.69,20.39 76.47,20.17 60.72,20.17 60.21,20.67 v1(60.21,24.61)
ISENSA1_PC1: length 39.7
  Top Layer w0.119: U1.7 6.67,30.13 6.49,29.95 6.49,28.42 7.14,27.77 v1(7.14,27.49)
  Inner1 w0.119: v1(7.14,27.49) 7.6,27.03 26.01,27.03 26.31,27.33 26.31,28.18 26.94,28.8 27.44,28.8 27.82,29.18 29.98,29.18 30.49,28.68 30.49,28.3 30.75,28.04 36.71,28.04 36.84,28.17 37.6,28.17 v1(38.11,28.68)
  Bottom Layer w0.119: U28.9 37.22,28.42 37.48,28.68 v1(38.11,28.68)
ISENSB1_PC0: length 40
  Top Layer w0.119: v1(26.81,29.31) 26.43,29.69 26.43,31.72 26.17,31.98 11.19,31.98 10.72,31.51 10.72,29.48 ; 10.72,29.48 10.42,29.18 10.42,27.57 R16.2 ; 10.72,29.48 U1.1
  Bottom Layer w0.119: v1(26.81,29.31) 26.55,29.06 26.55,27.41 26.68,27.28 28.08,27.28 28.21,27.15 28.21,26.26 28.71,25.75 36.46,25.75 36.72,26.01 36.72,27.12
ISENSB2_PC2: length 37.2
  Top Layer w0.119: R55.2 61.61,28.67 61.61,30.96 61.95,31.3 U20.1
  Bottom Layer w0.119: v1(62.75,27.53) 61.61,28.68 61.61,30.07 61.35,30.33 55.89,30.33 55.64,30.07 55.64,29.18 55.38,28.93 53.6,28.93 52.97,28.3 52.21,28.3 51.57,27.66 41.41,27.66 41.16,27.41 41.16,26.26 40.92,26.02 37.84,26.02 37.72,26.15 U28.10
ISENSC2_PC3: length 51.2
  Top Layer w0.119: R51.2 75.7,27.5 75.7,28.42 v1(75.45,28.68) 72.53,28.68 72.15,29.06 72.15,30.2 71.69,30.65 U20.7
  Inner1 w0.119: v1(38.87,28.55) 39.63,28.55 40.4,29.31 40.4,30.83 40.65,31.09 59.57,31.09 59.57,31.72 59.96,32.11 60.97,32.11 61.99,31.09 72.66,31.09 75.07,28.68 v1(75.45,28.68)
  Bottom Layer w0.119: v1(38.87,28.55) 38.22,27.89 U28.11
JTCK_SWCLK: length 26.5
  Bottom Layer w0.119: H1.4 18.68,31.98 18.68,29.56 19.06,29.18 23.89,29.18 24.9,28.17 24.9,23.72 26.55,22.07 26.55,18.14 27.14,17.55 U28.49
JTMS_SWDIO: length 42.2
  Top Layer w0.119: v1(24.4,20.42) 24.27,20.55 24.27,22.2 v1(24.9,22.83)
  Bottom Layer w0.119: H1.2 18.43,31.98 18.43,29.18 18.51,29.1 18.81,29.1 18.98,28.93 23.38,28.93 24.65,27.66 24.65,23.09 v1(24.9,22.83) ; v1(24.4,20.42) 24.4,19.21 24.78,18.83 24.78,15.09 25.28,14.58 30.24,14.58 30.62,14.2 30.62,11.28 31.13,10.77 34.05,10.77 34.22,10.94 34.22,15.5 34.34,15.62
LED: length 27.5
  Top Layer w0.119: v1(39.63,31.47) R63.1
  Inner1 w0.119: v1(44.84,29.18) 44.46,28.8 43.06,28.8 42.3,29.56 41.29,29.56 40.4,28.68 40.4,26.26 40.91,25.75 40.91,23.6 39.89,22.58 v1(39.89,18.26)
  Inner2 w0.119: v1(44.84,29.18) 44.84,30.96 44.33,31.47 v1(39.63,31.47)
  Bottom Layer w0.119: v1(39.89,18.26) 40.22,17.93 U28.34
M0_TEMP: length 7.5
  Bottom Layer w0.119: U28.20 43.87,23.55 44.21,23.22 RT1.1 46.76,23.08 C26.1 46.76,19.92 R8.2
OS_8M_IN: length 7.9
  Bottom Layer w0.127: U28.5 35.22,31.44 35.06,31.6 34.09,31.6 ; X1.1 31.95,31.6 C52.1
OS_8M_OUT: length 7.9
  Bottom Layer w0.127: U28.6 35.72,28.01 35.79,28.08 36.88,28.08 36.97,28.17 36.97,28.42 36.88,28.51 35.74,28.51 35.57,28.68 35.57,29.13 36.29,29.84 38.2,29.84 38.49,30.14
PWM_TIM1_CH1_PA8_INHA1: length 44.7
  Top Layer w0.119: v1(36.97,17.5) 37.48,16.99 38.49,16.99 38.62,16.86 38.62,13.94 38.37,13.69 27.19,13.69 26.43,14.45 26.43,17.12 25.92,17.63 25.28,17.63 25.03,17.88 25.03,20.55 25.28,20.8 25.28,21.31 25.03,21.56 25.03,22.22 25.64,22.83 25.92,22.83 26.17,23.09 26.17,28.3 25.54,28.93 19.02,28.93 18.76,28.67 U15.22
  Bottom Layer w0.119: U28.41 36.72,16.74 36.97,16.99 v1(36.97,17.5)
PWM_TIM1_CH1N_PA7_INLA1: length 43
  Top Layer w0.119: v1(16.9,28.93) 16.9,26.35 17.1,26.14
  Bottom Layer w0.119: v1(16.9,28.93) 17.16,28.68 23.25,28.68 24.4,27.53 24.4,22.45 24.8,22.05 26.05,22.05 26.17,21.93 26.17,18.14 27.19,17.12 34.05,17.12 34.43,17.5 34.43,20.29 34.68,20.55 40.14,20.55 40.4,20.8 40.4,21.82 40.63,22.05 U28.23
PWM_TIM1_CH2_PA9_INHB1: length 45
  Top Layer w0.119: 36.21,17.12 v1(36.33,17.12) ; v1(36.33,17.12) 36.33,17.25 ; v1(36.33,17.12) 36.33,16.99 36.59,16.74 38.24,16.74 38.37,16.61 38.37,14.2 38.11,13.94 27.44,13.94 26.68,14.71 26.68,17.25 26.05,17.88 25.54,17.88 25.28,18.14 25.28,20.42 25.66,20.8 25.66,21.31 25.28,21.69 25.28,22.07 25.79,22.58 26.05,22.58 26.43,22.96 26.43,28.8 25.92,29.31 18.96,29.31 18.26,28.62 18.26,26.8
  Bottom Layer w0.119: v1(36.33,17.12) 36.22,17 U28.42
PWM_TIM1_CH2N_PB0_INLB1: length 43.4
  Top Layer w0.119: v1(16.14,28.68) 16.14,26.26 16.76,25.64 17.1,25.64
  Bottom Layer w0.119: v1(16.14,28.68) 16.39,28.42 23,28.42 24.14,27.28 24.14,22.07 24.4,21.82 25.67,21.82 25.79,21.7 25.79,18.14 27.06,16.86 34.43,16.86 34.81,17.25 34.81,20.04 35.06,20.29 41.54,20.29 41.79,20.55 U28.26
PWM_TIM1_CH3_PA10_INHC1: length 36.8
  Top Layer w0.119: v1(35.7,18.39) 32.9,18.39 32.65,18.64 32.65,22.58 32.27,22.96 29.6,22.96 28.84,22.2 28.84,21.56 28.21,20.93 27.18,20.93 26.94,21.18 v1(26.94,23.6) ; U15.24 17.76,28.63 18.7,29.56 20.84,29.56 v1(21.09,29.82)
  Bottom Layer w0.119: v1(35.7,18.39) 35.72,18.37 U28.43 ; v1(21.09,29.82) 21.47,29.44 26.05,29.44 26.3,29.18 26.3,26.01 25.92,25.63 25.92,24.69 26.94,23.68 v1(26.94,23.6)
PWM_TIM1_CH3N_PB1_INLC1: length 47.4
  Top Layer w0.119: v1(16.27,25.37) 16.5,25.14 17.1,25.14
  Bottom Layer w0.119: 42.92,19.92 35.32,19.92 35.2,19.8 35.2,17.13 34.68,16.61 26.81,16.61 25.41,18.01 25.41,21.44 25.29,21.56 24.14,21.56 23.82,21.89 23.82,27.09 22.74,28.17 14.47,28.17 14.23,27.93 14.23,25.37 14.45,25.16 16.18,25.16 16.39,25.37
PWM_TIM8_CH1_PC6_INHA2: length 36.6
  Top Layer w0.119: v1(35.82,19.41) 35.19,20.04 v1(33.16,20.04) ; v1(52.34,26.77) 53.48,26.77 53.96,26.29 U21.22
  Bottom Layer w0.119: 40.65,25.37 42.3,27.03 51.8,27.03 52.06,26.77 v1(52.34,26.77) ; 40.65,25.37 40.65,23.34 40.4,23.09 34.05,23.09 33.41,22.45 33.41,20.29 v1(33.16,20.04) ; 40.65,25.37 40.65,25.5 ; v1(35.82,19.41) 38.37,19.41 38.75,19.02 38.75,15.65 U28.37
PWM_TIM8_CH1N_PA5_INLA2: length 19.6
  Top Layer w0.119: v1(52.27,24.63) 52.27,24.17 52.46,23.98 55,23.98 55.19,24.16 U21.1
  Bottom Layer w0.119: v1(52.27,24.63) 50.79,24.63 50.56,24.87 50.56,26.04 50.34,26.26 42.68,26.26 41.67,25.25 41.67,23.08 41.79,22.96 42.58,22.96 U28.21
PWM_TIM8_CH2_PC7_INHB2: length 35.5
  Top Layer w0.119: v1(36.59,18.9) 35.19,18.9 34.68,19.41 33.67,19.41 v1(33.54,19.28) ; U21.23 52.56,25.79 v1(52.34,26.01)
  Bottom Layer w0.119: U28.38 38.24,15.64 38.24,18.64 37.98,18.9 v1(36.59,18.9) ; v1(33.54,19.28) 33.67,19.41 33.67,22.2 34.3,22.83 40.65,22.83 41.03,23.22 41.03,25.37 42.43,26.77 51.57,26.77 v1(52.34,26.01)
PWM_TIM8_CH2N_PB14_INLB2: length 28.6
  Top Layer w0.119: U21.2 55.69,24.03 55.38,23.72 52.46,23.72 v1(52.21,23.47) ; v1(39.63,13.94) 39.89,13.69 51.32,13.69 52.21,14.58 v1(52.21,15.72)
  Bottom Layer w0.119: 52.08,23.47 51.7,23.09 51.7,21.94 52.21,21.44 52.21,18.01 51.83,17.63 51.83,15.98 52.08,15.72 ; v1(39.63,13.94) 39.72,14.03 U28.35
PWM_TIM8_CH3_PC8_INHC2: length 35.1
  Top Layer w0.119: v1(36.46,18.14) 36.21,17.88 v1(33.92,17.88) ; U21.24 52.17,25.29 v1(52.08,25.37)
  Bottom Layer w0.119: v1(36.46,18.14) 37.48,18.14 37.73,17.88 37.73,15.63 U28.39 ; v1(52.08,25.37) 51.06,25.37 50.94,25.5 50.94,26.26 50.68,26.52 42.56,26.52 41.41,25.37 41.41,23.09 40.91,22.58 34.68,22.58 34.05,21.94 34.05,18.01 v1(33.92,17.88)
PWM_TIM8_CH3N_PB15_INLC2: length 28.7
  Top Layer w0.119: v1(52.34,22.71) 53.1,23.47 55.89,23.47 56.15,23.72 56.15,24.58 U21.3 ; v1(52.34,17.25) 51.7,16.61 51.7,15.47 51.83,15.34 51.83,14.58 51.19,13.94 40.52,13.94 39.89,14.58 39.32,14.58 v1(39.09,14.35)
  Bottom Layer w0.119: v1(39.09,14.35) 39.22,14.48 U28.36 ; v1(52.34,22.71) 52.08,22.45 52.08,22.07 52.59,21.56 52.59,17.5 v1(52.34,17.25)
RST: length 37.9
  Top Layer w0.119: v1(42.05,30.58) 42.05,32.1 R61.2
  Inner2 w0.119: H1.10 28.59,31.98 28.59,29.31 28.21,28.93 v1(28.21,28.55)
  Bottom Layer w0.119: v1(28.21,28.55) 29.86,28.55 30.24,28.17 30.24,26.14 30.36,26.01 36.08,26.01 36.22,26.15 U28.7 ; C51.1 43.79,33.09 v1(40.65,33.09) 40.11,33.63 27.82,33.63 27.32,33.12
SHA1: length 26
  Top Layer w0.188: U15.18 20.92,26.98 21.47,27.53 v1(22.55,27.53)
  Bottom Layer w0.201: v1(22.55,27.53) 21.09,27.53 20.84,27.28 20.84,20.11 20.64,19.91 15.63,19.91 15.12,19.41 8.01,19.41 7.63,19.02 v1(7.63,18.39)
  vias: v1(2.62,12.87) v1(2.62,12.23) v1(2.62,11.59) v1(2.62,10.96) v1(2.62,10.33) v1(3.41,12.87) v1(3.41,12.23) v1(3.41,11.59) v1(3.41,10.96) v1(3.41,10.33) v1(4.36,12.8) v1(4.36,12.16) v1(4.36,11.52) v1(4.36,10.9) v1(4.36,10.26) v1(5.15,12.8) v1(5.15,12.16) v1(5.15,11.52) v1(5.15,10.9) v1(5.15,10.26) v1(5.97,12.83) v1(5.97,12.19)
SHA2: length 27.8
  Top Layer w0.119: C35.1 52.15,32.87 52.97,32.87 53.1,32.74 53.1,30.58 53.35,30.33 55,30.33 55.19,30.14 U21.18
  Top Layer w0.201: C35.1 52.02,32.87 49.29,32.87 48.91,32.49 48.91,30.71 49.54,30.07 51.06,30.07 51.45,29.69 51.45,22.45 52.08,21.82 52.08,19.79 Q27.9
SHB1: length 16.2
  Top Layer w0.188: U15.15 22.52,24.64 22.55,24.67 v1(22.55,25.63)
  Bottom Layer w0.201: v1(22.55,25.63) 22.55,19.85 22.24,19.53 16.01,19.53 15.63,19.15 v1(15.63,18.52)
  vias: v1(10.68,12.79) v1(10.7,12.15) v1(10.73,11.52) v1(10.78,10.89) v1(10.78,10.25) v1(11.4,12.79) v1(11.42,12.15) v1(11.45,11.52) v1(11.5,10.89) v1(11.5,10.25) v1(12.12,12.79) v1(12.14,12.15) v1(12.17,11.52) v1(12.22,10.89) v1(12.22,10.25) v1(12.84,12.79) v1(12.86,12.15) v1(12.89,11.52) v1(12.94,10.89) v1(12.94,10.25) v1(13.56,12.79) v1(13.58,12.15) v1(14.28,12.81) v1(14.3,12.17)
SHB2: length 27.6
  Top Layer w0.119: U21.15 56.69,32.69 56.57,32.81 C33.1
  Top Layer w0.201: Q28.9 61.96,27.44 61.22,28.17 61.22,33.88 60.83,34.28 56.41,34.28 56.02,33.88 C33.1
SHC1: length 8.9
  Top Layer w0.188: 20.26,22.99 22.07,22.99 C18.1
  Top Layer w0.201: C18.1 22.74,23.53 22.74,21.94 23,21.69 23.63,21.69 23.89,21.44 23.89,18.37 v1(23.82,18.3)
  vias: v1(17.48,17.85) v1(17.48,17.13) v1(17.48,16.41) v1(17.47,15.71) v1(18.12,17.87) v1(18.12,17.15) v1(18.12,16.43) v1(18.11,15.73) v1(18.89,12.8) v1(18.91,12.16) v1(18.94,11.52) v1(19,10.9) v1(19,10.26) v1(19.61,12.8) v1(19.63,12.16) v1(19.66,11.52) v1(19.72,10.9) v1(19.72,10.26) v1(20.33,12.8) v1(20.35,12.16) v1(20.38,11.52) v1(20.44,10.9) v1(20.44,10.26) v1(21.05,12.8) v1(21.07,12.16) v1(21.1,11.52) v1(21.16,10.9) v1(21.16,10.26) v1(21.77,12.8) v1(21.79,12.16) v1(23.83,17.58) v1(23.83,16.86) v1(23.83,16.14)
SHC2: length 28.7
  Top Layer w0.201: v1(63.13,32.36) 63.38,32.11 67.83,32.11 68.34,31.6 68.34,27.91 70.09,26.17 Q31.9 ; v1(60.3,31.41) 60.34,31.36 60.46,31.36 60.46,28.04 60.21,27.79 U21.12
  Bottom Layer w0.201: v1(63.13,32.36) 63,32.49 61.38,32.49 v1(60.3,31.41)
SNA1: length 3
  Top Layer w0.201: R23.1 5.62,25.32 5.06,24.76 5.06,24.34 5.04,24.32 5.04,24.16 5.35,23.85 U47.1
SNB1: length 3.1
  Top Layer w0.201: R19.2 12.03,25.32 12.57,24.78 12.57,24.1 12.19,23.72 12.19,23.22
SNB2: length 3.2
  Top Layer w0.201: 64.52,23.09 64.78,23.35 64.78,25.51 R57.2
SNC2: length 3
  Top Layer w0.201: R54.1 74.05,25.86 74.05,25.25 73.68,24.87 73.68,23.34 73.81,23.22
SPA1: length 3
  Top Layer w0.201: U46.1 4.32,23.85 4.63,24.16 4.63,24.78 4.09,25.32 R26.1
SPB1: length 3.2
  Top Layer w0.201: 13.35,23.22 13.35,23.72 12.98,24.09 12.98,24.32 13,24.34 13,24.76 13.56,25.32 R21.2
SPB2: length 3.2
  Top Layer w0.201: R58.2 65.86,25.82 65.29,25.25 65.29,23.35 65.55,23.09
SPC2: length 3
  Top Layer w0.201: 72.77,23.22 73.03,23.47 73.03,24.87 72.66,25.25 72.66,25.93 R53.1
USART1_RX: length 21.8
  Inner1 w0.119: v1(32.01,27.28) 32.01,26.26 31.89,26.14 28.33,26.14 27.7,25.5 27.7,23.6 28.33,22.96 28.33,22.02 v1(29.32,21.03)
  Bottom Layer w0.119: U28.58 29.32,22.05 28.97,21.69 28.97,20.8 29.22,20.8 29.47,21.06 ; v1(32.01,27.28) 32.01,27.41 31.38,28.04 31.38,28.42 31.13,28.68 30.87,28.68 30.11,29.44 27.44,29.44 27.32,29.56 27.32,30.45 H1.9
USART1_TX: length 28.4
  Inner1 w0.119: v3(28.46,20.42) 27.19,21.69 27.19,23.09 27.44,23.34 27.44,25.63 28.33,26.52 30.36,26.52 30.75,26.9 30.75,27.66 30.87,27.79 32.52,27.79 32.52,27.66 v1(32.65,27.53)
  Bottom Layer w0.119: H1.7 26.17,31.85 28.33,31.85 28.71,31.47 28.71,29.95 28.97,29.69 30.24,29.69 31,28.93 31.25,28.93 31.63,28.55 31.63,28.17 31.89,27.91 32.27,27.91 v1(32.65,27.53) ; U28.59 28.94,22.55 28.46,22.07 v3(28.46,20.42)
VBA1: length 6.5
  Top Layer w0.119: C27.2 23.89,27.85 23.89,28.42 23.69,28.62 20.14,28.62 19.76,28.23 U15.20
VBA2: length 8.4
  Top Layer w0.119: U23.1 50.37,31.53 C35.2 52.08,27.53 52.33,27.29 U21.20
VBB1: length 5.1
  Top Layer w0.119: U15.17 21.62,25.64 21.98,26.01 21.98,26.52 22.24,26.77 24.01,26.77 24.14,26.64 24.14,25.69 24.08,25.63
VBB2: length 4.8
  Top Layer w0.119: 55.71,31.09 55.71,31.4 55.66,31.45 54.52,31.45 U24.1 ; 55.71,31.09 C33.2 ; 55.71,31.09 55.69,31.08 U21.17
VBC1: length 3.9
  Top Layer w0.119: U15.14 21.39,24.14 21.6,24.36 23.89,24.36 24.08,24.17 24.08,23.6
VBC2: length 6.5
  Top Layer w0.119: C34.2 59.51,32.11 58.81,32.11 58.43,31.72 U22.1 58.3,30.71 57.54,30.71 57.19,30.36 U21.14
$1N1196:
  vias: v2(10.41,16.67) v2(10.41,15.84) v2(10.46,18.38) v2(10.46,17.55) v2(11.11,18.4) v2(11.11,17.55) v2(11.06,16.69) v2(11.06,15.84) v2(11.96,18.37) v2(11.96,17.54) v2(11.96,16.67) v2(11.96,15.84) v2(12.61,18.39) v2(12.61,17.54) v2(12.61,16.69) v2(12.61,15.84) v2(13.34,18.37) v2(13.34,17.54) v2(13.99,18.39) v2(13.99,17.54)
$1N1202: length 5.2
  Top Layer w0.119: R2.1 7.11,20.54 6.87,20.29 6.87,16.99 6.49,16.61 6.05,16.61 6.01,16.65
$1N1207: length 5.3
  Top Layer w0.119: 14.01,16.4 14.1,16.3 14.56,16.3 14.74,16.48 14.74,19.91 15.12,20.29 R13.1
$1N1208: length 2.5
  Top Layer w0.119: 14.62,8.73 14.55,8.8 14.77,9.02 14.77,10.05 14.01,10.81
$1N1213: length 3
  Top Layer w0.119: 22.27,10.55 22.62,10.2 22.62,7.84 22.74,7.71
$1N1222: length 5.4
  Top Layer w0.119: 23.24,20.8 23.24,16.6 22.74,16.1 22.31,16.1 22.27,16.14
$1N1227:
  vias: v2(2.75,18.66) v2(2.75,17.82) v2(2.7,16.95) v2(2.7,16.11) v2(3.35,16.97) v2(3.35,16.11) v2(3.39,18.68) v2(3.39,17.82) v2(4.25,18.65) v2(4.25,17.81) v2(4.25,16.95) v2(4.25,16.11) v2(4.9,18.67) v2(4.9,17.81) v2(4.9,16.97) v2(4.9,16.11) v2(5.63,18.65) v2(5.63,17.81) v2(6.28,18.67) v2(6.28,17.81)
$1N1611: length 8.2
  Top Layer w0.119: R16.1 12.01,27.49 R19.1 12.03,28.5 12.46,28.93 14.36,28.93 14.62,29.18 14.62,29.95 14.36,30.2 13.42,30.2 U1.2
$1N1616: length 6.5
  Top Layer w0.119: R22.1 15.12,27.53 15.12,30.58 14.93,30.78 U1.3
  Top Layer w0.254: R21.1 R22.1
$1N1624: length 7
  Top Layer w0.119: U1.6 7.44,30.83 6.36,30.83 5.98,30.45 5.98,28.55 5.62,28.19 R23.2 7.12,25.98 R15.1
$1N1625: length 8.4
  Top Layer w0.119: R26.2 4.15,27.54 4.15,28.32 4.33,28.5 5.17,28.5 5.47,28.8 5.47,31.09 5.81,31.43 U1.5
  Top Layer w0.254: R20.2 R26.2
$1N3933: length 3.8
  Top Layer w0.119: Q26.1 58.34,8.95 59.19,8.1 59.96,8.1 R40.1
$1N3934: length 6
  Top Layer w0.119: Q27.1 59.1,16.14 59.45,16.48 59.45,20.43 59.57,20.55 60.33,20.55 R41.1
$1N3940: length 6.3
  Top Layer w0.119: Q28.1 66.76,16.1 67.57,16.1 67.82,16.35 67.82,20.43 67.94,20.55 68.71,20.55 R43.1
$1N3941: length 2.8
  Top Layer w0.119: R42.1 66.72,8.1 Q29.1
$1N3946: length 2.9
  Top Layer w0.119: Q30.1 74.84,8.21 R44.1
$1N3955: length 6
  Top Layer w0.119: R45.1 76.46,20.55 75.95,20.55 75.7,20.3 75.7,16.36 75.45,16.1 74.88,16.1 Q31.1
$1N4496: length 8.4
  Top Layer w0.119: U20.2 62.57,30.65 62.24,30.33 62.24,28.68 62.5,28.42 64.02,28.42 64.34,28.1 R57.1 64.32,27.46 R55.1
$1N4501: length 5.9
  Top Layer w0.119: U20.3 63.81,29.95 65.42,29.95 65.86,29.5 R58.1 R56.1
$1N4509: length 8.5
  Top Layer w0.119: U20.6 70.95,30 71.64,29.31 71.64,28.55 72.02,28.17 73.93,28.17 74.18,27.91 74.18,27.49 R54.2 74.16,27.46 R51.1
$1N4510: length 4.6
  Top Layer w0.119: U20.5 70.58,29.35 71.12,28.82 R52.2
  Top Layer w0.254: R53.2 R52.2
$1N6360: length 3.9
  Top Layer w0.119: R1.1 6.49,8.36 6.14,8.71 6.14,10.94 6.01,11.06
$1N6885:
  vias: v2(71.53,16.54) v2(71.53,15.71) v2(71.58,18.26) v2(71.58,17.42) v2(72.23,18.28) v2(72.23,17.42) v2(72.18,16.56) v2(72.18,15.71) v2(73.08,18.24) v2(73.08,17.41) v2(73.08,16.54) v2(73.08,15.71)
$1N8266:
  vias: v2(63.65,16.54) v2(63.65,15.71) v2(63.7,18.26) v2(63.7,17.42) v2(64.35,18.28) v2(64.35,17.42) v2(64.3,16.56) v2(64.3,15.71) v2(65.2,18.24) v2(65.2,17.41) v2(65.2,16.54) v2(65.2,15.71) v2(65.85,18.26) v2(65.85,17.41) v2(65.85,16.56) v2(65.85,15.71) v2(66.58,18.24) v2(66.58,17.41)
$2N407: length 6.9
  Top Layer w0.119: U13.3 29.29,19.09 28.97,18.77 28.21,18.77 27.7,19.28 27.05,19.28 R30.2 ; 25.88,19.99 26.18,20.29 26.18,22.07
$2N408: length 3
  Top Layer w0.119: 31.19,19.99 31.19,20.61 30.87,20.93 30.24,20.93 29.98,21.18 29.98,22.01 C39.1
$2N410: length 3.8
  Top Layer w0.119: 27.7,16.98 27.7,18.14 27.95,18.39 29.09,18.39 29.29,18.2 U13.4
$2N2951:
  vias: v1(37.75,6.7) v1(37.73,5.96) v1(37.75,5.18) v1(37.75,4.42) v1(37.75,3.65) v1(37.75,2.89) v1(37.75,2.12) v1(37.75,1.36) v1(37.75,0.6) v1(39.04,6.71) v1(39.04,5.96) v1(39.04,5.18) v1(39.04,4.42) v1(39.04,3.66) v1(39.04,2.89) v1(39.04,2.13) v1(39.04,1.37) v1(39.04,0.6) v1(40.35,5.95) v1(40.37,6.7) v1(40.4,5.19) v1(40.4,4.42) v1(40.4,3.66) v1(40.4,2.89) v1(40.4,2.13) v1(40.4,1.37) v1(40.4,0.61) v1(41.68,6.7) v1(41.66,5.95)
$3N2156: length 9
  Bottom Layer w0.119: 44.09,28.42 44.22,28.55 44.22,29.81 43.95,30.07 41.03,30.07 40.71,29.75 40.71,28.68 40.02,28.68 39.25,27.91 39.25,27.03 U28.13
$3N2326: length 2.8
  Bottom Layer w0.119: C48.1 33.72,13.05 U28.47
$3N2403: length 2.5
  Bottom Layer w0.119: U28.31 44.82,18.05 C50.2
$3N2502: length 10.4
  Bottom Layer w0.119: U28.60 26.34,23.05 25.58,23.81 25.58,28 25.54,28.04 BOOT_RES.2
$3N3085: length 2.5
  Bottom Layer w0.119: v1(42.18,33.88) 42.36,33.69 C51.2
$3N3763: length 1.8
  Top Layer w0.119: 37,31.47 35.18,31.47 LED3.2
$3N3864: length 2.2
  Top Layer w0.119: 35.3,27.53 37.48,27.53 37.48,27.53
$3N3935: length 2.1
  Top Layer w0.254: LED5.2 41.92,25.37 43.7,25.37

## Copper pours and planes (outline as drawn; the poured copper is in the pictures)
5V on Top Layer: 29.58,24.17 31.84,24.17 31.84,23.17 29.58,23.17
5V on Top Layer: 31.76,23.09 33.28,23.09 33.67,23.47 33.67,25.88 33.54,26.01 31.51,26.01 31.38,25.88 31.38,25.25 31.51,25.12 32.65,25.12 32.78,24.99 32.78,24.17 31.57,24.17 31.38,23.98 31.38,23.47
5V on Top Layer: 43,22.37 43.19,22.56 43.19,24.36 44.01,24.36 44.01,22.38 43.95,22.33 43.04,22.33
5V on Top Layer: 34.68,22.45 33.67,23.47 33.54,23.34 32.59,23.34 32.59,23.15 34.17,21.56 40.27,21.56 41.03,20.8 41.03,17.39 41.38,17.05 44.15,17.05 44.15,18.21 43.33,19.02 42.3,19.02 42.3,20.92 42.93,21.55 43.81,21.55 44.08,21.82 44.08,22.45
5V on Top Layer: 29.6,24.16 29.6,23.25 28.06,21.71 27.31,21.71 27.31,22.09 29.38,24.16
12V on Top Layer: 27.06,23.72 27.06,28.16 27.43,28.53 30.88,28.53 31.26,28.15 31.26,26.91 31.13,26.78 28.67,26.78 28.08,26.19 28.08,23.46 27.33,23.46
12V on Top Layer: 54.88,20.38 54.88,19.27 56.26,19.27 56.4,19.41 56.4,20.42 56.27,20.55 55.04,20.55
12V on Top Layer: 48.65,16.86 49.79,16.86 49.92,16.74 49.92,15.24 51.21,15.24 51.21,17.61 51.06,17.75 48.64,17.75 48.64,16.88
12V on Top Layer: 54.88,23.22 56.27,23.22 56.27,20.38 54.88,20.38
12V on Inner2: 52.97,34.39 52.97,22.83 53.72,22.09 56.29,22.09 56.4,22.2 56.4,23.09 56.27,23.22 54.49,23.22 54.24,23.47 54.24,34.38
12V on Inner2: 50.04,33.63 54.88,33.63 55.89,32.61 58.71,32.61 58.71,33.61 58.69,33.63 56.02,33.63 55.26,34.39 50.18,34.39 50.04,34.26
12V on Inner2: 49.92,16.61 49.92,19.15 51.19,20.42 56.27,20.42 56.4,20.29 56.4,19.41 56.27,19.28 51.8,19.28 51.19,18.65 51.19,16.61
12V on Inner2: 54.36,34.4 30.27,34.4 28.59,32.71 28.59,27.79 29.86,27.79 29.86,32.36 31.2,33.7 54.83,33.7 54.37,34.17 54.37,34.39
DGND on Top Layer: -5.83,39.09 82.05,39.09 82.05,-6.12 -5.83,-6.12
DGND on Bottom Layer: -6.59,41.63 102.25,41.63 102.25,-10.06 -6.59,-10.06
DGND on Inner2: -6.97,41.5 95.01,41.5 95.01,-16.54 -6.97,-16.54
PGND on Top Layer: 26.81,13.44 51.57,13.44 51.57,11.95 26.81,11.95
PGND on Top Layer: 75.34,24.02 77.02,24.02 77.02,23.09 76.89,22.96 75.34,22.96
PGND on Top Layer: 62.98,23.54 62.98,25.22 63.91,25.22 64.04,25.09 64.04,23.54
PGND on Top Layer: 6.79,23.98 10.81,23.98 10.81,22.76 6.79,22.76
PGND on Inner1: -3.04,38.71 85.74,38.71 85.74,-6.63 -3.04,-6.63
VCC on Top Layer: 33.79,24.48 40.02,24.48 40.02,27.91 38.64,27.91 38.64,26.01 33.79,26.01
VCC on Inner2: 2.14,25.51 3.23,25.51 6.65,28.93 7.38,28.93 10.08,31.64 10.08,34.27 9.04,34.27 8.77,34.01 8.77,32.01 6.58,29.82 5.81,29.82 2.38,26.39 2.17,26.39 2.17,25.54
VCC on Inner2: 14.63,25.49 14.63,21.81 15.38,21.06 35.68,21.06 36.11,21.49 36.11,25.46 35.5,26.07 34.84,26.07 34.46,25.69 34.46,22.48 34.02,22.04 16.79,22.04 15.99,22.83 15.99,25.49
VCC on Inner2: 14.63,31.08 14.63,25.49 15.99,25.49 15.99,29.42 16.27,29.69 18.04,29.69 18.04,31.35 17.92,31.47 16.01,31.47 13.22,34.26 10.09,34.26 10.08,34.27 10.08,33.31 12.39,33.31 14.62,31.08
VCC on Inner2: 67.38,21.88 66.56,21.06 35.57,21.06 36.08,21.56 36.08,21.82 66.05,21.82 66.56,22.33 66.56,26.09 67.38,26.71
VCC on Inner2: 67.07,33.63 67.7,33.63 67.83,33.5 67.83,26.52 68.08,26.26 71.51,26.26 71.64,26.14 71.64,25.56 71.58,25.5 67.34,25.5 66.92,25.91 66.92,33.49
DCBUS on Top Layer: 45.64,0.61 52.21,0.61 52.84,1.24 52.84,7.96 52.13,8.67 52.13,10.21 51.57,10.77 26.81,10.77 26.43,10.39 26.43,8.61 27.57,7.47 42.68,7.47 44.75,5.4 44.75,1.5
DCBUS on Top Layer: 15.25,13.31 17.79,13.31 17.79,9.75 15.25,9.75
DCBUS on Top Layer: 26.81,8.75 26.81,10.22 51.57,10.22 51.57,8.74 26.81,8.74
DCBUS on Top Layer: 24.78,14.45 23.38,13.06 23.38,9.47 24.27,8.58 26.9,8.58 27.19,8.86 27.19,13.8 26.53,14.45
DCBUS on Top Layer: 67.95,9.57 70.44,9.57 70.5,9.63 70.5,13.99 70.04,14.45 68.58,14.45 67.95,13.82
DCBUS on Top Layer: 45.35,17.76 46.62,17.76 46.62,13.94 45.35,13.94
DCBUS on Top Layer: 7.25,13.31 9.66,13.31 9.66,9.75 7.25,9.75
DCBUS on Top Layer: 59.7,13.18 62.24,13.18 62.24,9.63 59.7,9.63
DCBUS on Inner2: 45.35,15.09 55.46,15.09 55.46,13.94 45.35,13.94
DCBUS on Inner2: 29.21,16.09 29.79,16.67 29.79,17.81 29.98,18.01 30.49,18.01 30.75,17.75 30.75,16.44 31.07,16.11 32.39,16.11 32.52,15.98 32.52,15.97 32.52,14.83 32.4,14.71 27.32,14.71 26.3,13.69 24.91,13.69 24.69,14.11 26.68,16.1 29.2,16.1
DCBUS on Inner2: 0.9,14.58 0.52,14.2 0.52,9.63 0.9,9.25 1.79,9.25 2.04,9.5 2.04,12.93 2.42,13.31 6.61,13.31 6.74,13.18 6.74,9.75 7.12,9.37 9.79,9.37 10.04,9.63 10.04,12.93 10.42,13.31 14.36,13.31 14.74,12.93 14.74,9.63 15,9.37 17.92,9.37 18.3,9.75 18.3,12.93 18.68,13.31 22.74,13.31 23,13.06 23,8.86 23.35,8.51 26.68,8.51 26.81,8.63 26.81,10.64 26.37,11.08 26.37,13.75 25.54,14.58
DCBUS on Inner2: 26.68,10.72 26.82,10.86 51.57,10.86 52.21,11.5 52.21,13.56 52.84,14.2 76.47,14.2 76.97,13.69 76.97,9.88 76.72,9.63 76.08,9.63 75.83,9.88 75.83,10.52 75.32,11.02 70.88,11.02 70.62,10.77 70.62,9.87 70.37,9.61 68.22,9.61 67.96,9.88 67.96,10.9 67.7,11.15 62.88,11.15 62.37,10.64 62.37,9.88 62.11,9.63 59.83,9.63 59.57,9.88 59.57,10.71 59.19,11.15 55.38,11.15 54.88,10.64 54.88,8.23 54.15,7.5 24.26,7.5 23.25,8.51 26.67,8.51 26.68,8.52
SHA1 on Top Layer: 10.04,5.05 6.74,8.36 6.74,12.85 8.14,14.25 8.14,18.9 7.31,18.9 7.31,16.03 6.63,15.34 2.04,15.34 1.79,15.59 1.79,18.64 1.33,19.1 0.85,19.1 0.65,18.9 0.65,14.47 1.33,13.79 1.94,13.79 2.3,13.44 2.3,6.96 6.23,3.02 6.23,1.24 7.38,0.1 9.46,0.1 10.04,0.68
SHA2 on Top Layer: 54.75,7.35 54.75,12.67 53.1,14.33 53.1,18.9 53.48,19.28 54.24,19.28 54.49,19.02 54.49,15.72 55.13,15.09 59.07,15.09 59.45,15.47 59.45,19.17 59.81,19.53 60.72,19.53 61,19.25 61,14.96 58.56,12.52 58.56,8.74 61.51,5.78 62.91,5.78 64.02,4.67 64.02,0.36 63.64,0.07 60.62,0.07 60.34,0.36 60.34,1.76
SHB1 on Top Layer: 13.71,12.27 14.87,13.44 16.65,13.44 16.65,18.9 15.12,18.9 15.12,15.59 14.62,15.09 9.96,15.09 9.83,15.21 9.83,18.6 9.54,18.9 9.03,18.9 8.77,18.64 8.77,13.84 10.06,12.56 10.06,0.19 10.47,-0.22 13.39,-0.22 13.71,0.1
SHB2 on Top Layer: 67.7,12.36 67.7,13.87 69.23,15.4 69.23,18.9 68.72,19.41 68.08,19.41 67.7,19.02 67.7,15.63 67.11,15.04 63.43,15.04 63,15.47 63,18.77 62.37,19.41 61.73,19.41 61.35,19.02 61.35,14.33 62.62,13.06 62.62,7.21 64.22,5.61 64.22,0.83 64.95,0.1 67.24,0.1 67.64,0.5 67.64,5.92 66.16,7.4 66.16,10.82
SHC1 on Top Layer: 23.16,18.84 23,18.68 23,15.6 22.74,15.34 18.81,15.34 18.55,15.59 18.55,18.9 16.9,18.9 16.9,14.2 18.04,13.06 18.04,9.12 14.11,5.18 14.11,0.33 14.36,0.08 18.17,0.08 18.17,3.02 21.9,6.75 21.9,11.96 24.62,14.68 24.62,18.67 24.45,18.84
